# Altium schematic sheet ICM20608.SchDoc
size A4; SheetNumber: 7; SheetTotal: 8
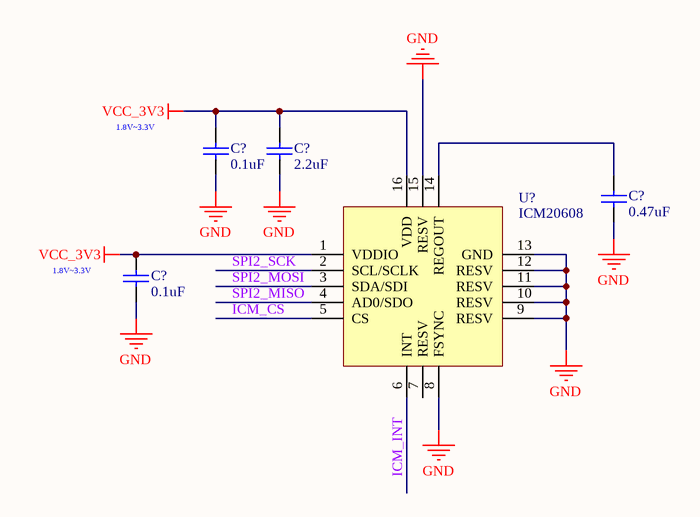
[diagram p0: ICM20608.SchDoc]

## Parts
(Parts that share a designator on the sheet are numbered #1, #2 ... from top to bottom, then left to right.)
C?#1  0.1uF  [C0402_L]
C?#2  2.2uF  [C0402_L]
C?#3  0.47uF  [C0402_L]
C?#4  0.1uF  [C0402_L]
U?  ICM20608  [LGA16     3*3*0.75]

## Nets
GND: C?#1.1 C?#2.1 C?#3.2 C?#4.2 U?.8(FSYNC) U?.9(RESV) U?.10(RESV) U?.11(RESV) U?.12(RESV) U?.13(GND) U?.15(RESV)
VCC_3V3: C?#1.2 C?#2.2 C?#4.1 U?.1(VDDIO) U?.16(VDD)
ICM_CS: U?.5(CS)
ICM_INT: U?.6(INT)
SPI2_MISO: U?.4(AD0/SDO)
SPI2_MOSI: U?.3(SDA/SDI)
SPI2_SCK: U?.2(SCL/SCLK)
NetC?#3_1: C?#3.1 U?.14(REGOUT)

Not connected (* = marked no-connect by the designer): U? 7(RESV)

## Notes on the sheet
- (near C?#1) 1.8V~3.3V
- (near C?#4) 1.8V~3.3V

## Library data of the parts
C?#1-C?#4 = C: 贴片电容; BOM名称: 无极性贴片电容; 联系卖家，免费查找封装: 唯一出售店铺网址https://shop463601444.taobao.com
U? = ICM20608-G: 六轴姿态传感器